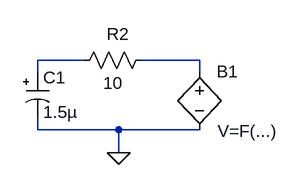
[diagram p0: schematic Draft1.asc]
Draft1.asc, the LTspice schematic file:
Version 4
SHEET 1 880 680
WIRE 112 112 48 112
WIRE 272 112 192 112
WIRE 48 128 48 112
WIRE 272 128 272 112
WIRE 48 208 48 192
WIRE 160 208 48 208
WIRE 272 208 160 208
WIRE 160 240 160 208
FLAG 160 240 0
SYMBOL polcap 32 128 R0
WINDOW 3 24 56 Left 2
SYMATTR InstName C1
SYMATTR Value 1.5µ
SYMATTR Description Capacitor
SYMATTR Type cap
SYMATTR SpiceLine V=16 Irms=0 Rser=8 Lser=0 mfg="AVX" pn="TAJA155K016" type="Tantalum"
SYMBOL res 208 96 R90
WINDOW 0 -4 49 VBottom 2
WINDOW 3 32 56 VTop 2
SYMATTR InstName R2
SYMATTR Value 10
SYMATTR SpiceLine tol=1 pwr=0.1
SYMBOL bv 272 112 R0
WINDOW 3 25 98 Left 2
SYMATTR InstName B1

The netlist it stands for:
* Draft1.asc
C1 N001 0 1.5µ V=16 Irms=0 Rser=8 Lser=0 mfg="AVX" pn="TAJA155K016" type="Tantalum"
R2 N002 N001 10 tol=1 pwr=0.1
B1 N002 0 V=F(...)
.backanno
.end